# EAGLE schematic PowerSupply (EAGLE 9.0.0)

## Sheet 1 of 2
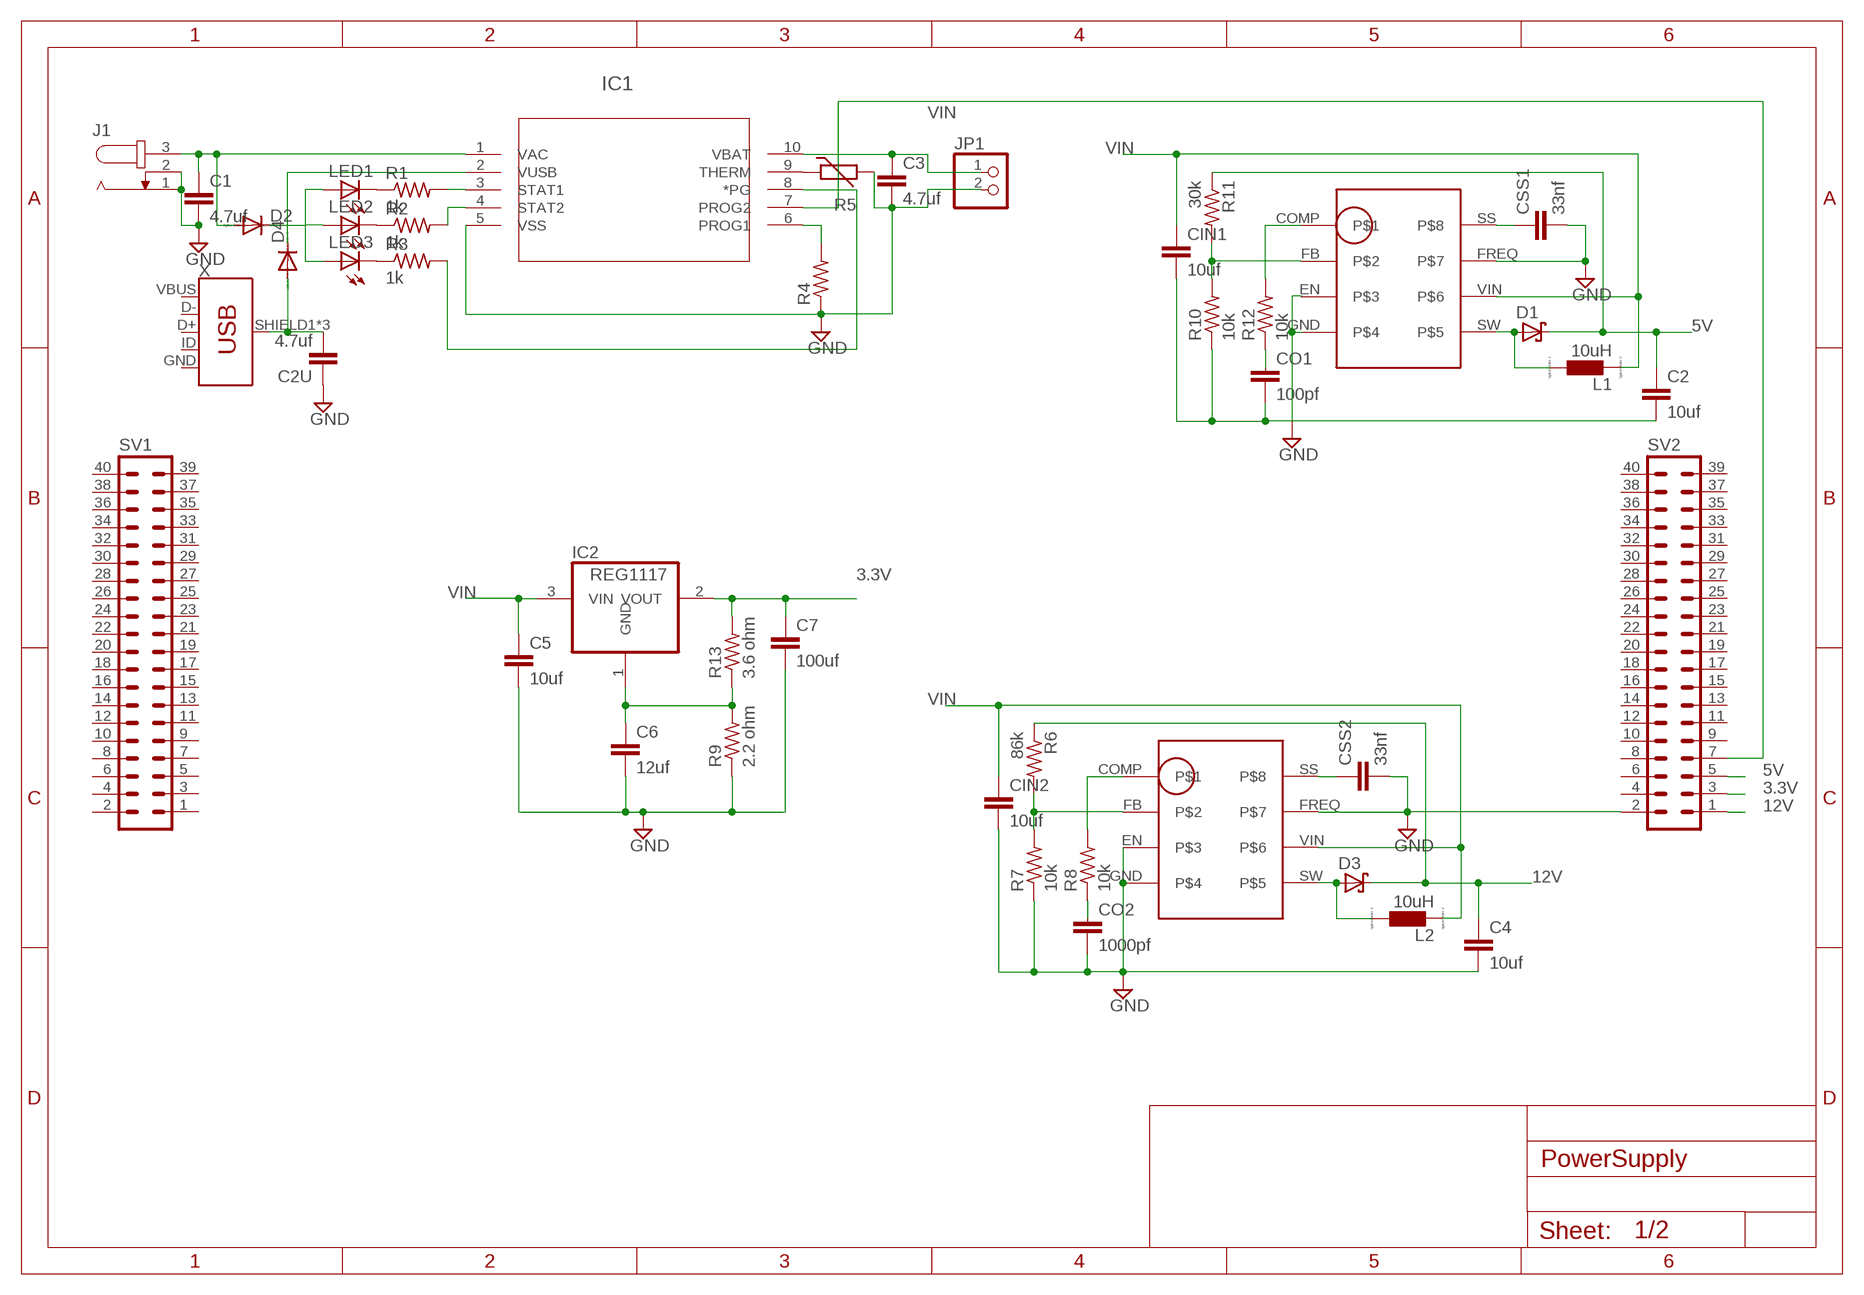
[diagram p0: schematic, sheet 1]

### Parts
C1  4.7uf  C-EUC1206  [C1206]
C2  10uf  C-EUC1206  [C1206]
C2U  4.7uf  C-EUC1206  [C1206]
C3  4.7uf  C-EUC1206  [C1206]
C4  10uf  C-EUC1206  [C1206]
C5  10uf  C-EUC1206  [C1206]
C6  12uf  C-EUC1206  [C1206]
C7  100uf  C-EUC1206  [C1206]
CIN1  10uf  C-EUC1206  [C1206]
CIN2  10uf  C-EUC1206  [C1206]
CO1  100pf  C-EUC1206  [C1206]
CO2  1000pf  C-EUC1206  [C1206]
CSS1  33nf  C-EUC1206  [C1206]
CSS2  33nf  C-EUC1206  [C1206]
D1  SCHOTTKY-DIODECB429-15  [CB429-15]
D2  DIODE-SOD123  [SOD123]
D3  SCHOTTKY-DIODECB429-15  [CB429-15]
D4  DIODE-SOD123  [SOD123]
IC1  MCP73837-FCI/UN  [SOP50P490X110-8N]
IC2  REG1117  [SOT223]
J1  JACK-PLUG1  [SPC4078]
JP1  PINHD-1X2  [1X02]
L1  10uH  L0204/7  [0204/7]
L2  10uH  L0204/7  [0204/7]
LED1  LEDSMT1206  [1206]
LED2  LEDSMT1206  [1206]
LED3  LEDSMT1206  [1206]
R1  1k  R-US_R2010  [R2010]
R2  1k  R-US_R2010  [R2010]
R3  1k  R-US_R2010  [R2010]
R4  R-US_R2010  [R2010]
R5  THERMISTOR-7,5  [R-7,5]
R6  86k  R-US_R2010  [R2010]
R7  10k  R-US_R2010  [R2010]
R8  10k  R-US_R2010  [R2010]
R9  2.2 ohm  R-US_MELF0207R  [MINI_MELF-0207R]
R10  10k  R-US_R2010  [R2010]
R11  30k  R-US_R2010  [R2010]
R12  10k  R-US_R2010  [R2010]
R13  3.6 ohm  R-US_MELF0207R  [MINI_MELF-0207R]
SV1  MA20-2  [MA20-2]
SV2  MA20-2  [MA20-2]
U1  ADP1613  ADP1613_DEV  [ADP1613_PAC]
U3  ADP1613  ADP1613_DEV  [ADP1613_PAC]
X  USB_MICRO-B_FEMALE-SMT  [USB-B-MICRO-SMD]

### Nets
3.3V: C7.1 IC2.2(VOUT) R13.2 SV2.3
5V: C2.1 D1.C R11.1 SV2.5
12V: C4.1 D3.C R6.1 SV2.1
GND: C1.2 C2.2 C2U.1 C3.2 C4.2 C5.2 C6.2 C7.2 CIN1.2 CIN2.2 CO1.2 CO2.2 CSS1.2 CSS2.2 IC1.5(VSS) J1.1 J1.2 JP1.2 R4.1 R5.2 R7.1 R9.1 R10.1 SV2.2 U1.FREQ U3.EN U3.FREQ U3.GND
N$1: IC1.3(STAT1) R1.2
N$2: IC1.4(STAT2) R2.2
N$3: LED3.C R3.1
N$4: LED1.C R1.1
N$5: LED2.C R2.1
N$6: IC1.8(*PG) R3.2
N$7: D2.C LED1.A LED2.A LED3.A
N$8: D4.C IC1.2(VUSB)
N$9: C1.1 D2.A IC1.1(VAC) J1.3
N$10: IC1.6(PROG1) R4.2
N$11: IC1.9(THERM) R5.1
N$12: CO2.1 R8.1
N$13: R12.2 U1.COMP
N$14: CO1.1 R12.1
N$15: R10.2 R11.2 U1.FB
N$16: R6.2 R7.2 U3.FB
N$17: D3.A L2.1 U3.SW
N$18: CSS2.1 U3.SS
N$19: D1.A L1.1 U1.SW
N$20: R8.2 U3.COMP
N$23: CSS1.1 U1.SS
N$24: C2U.2 D4.A X.SHIELD1(SHIELD) X.SHIELD2(SHIELD) X.SHIELD3(SHIELD)
N$25: IC1.7(PROG2) SV2.7
N$26: C6.1 IC2.1(GND) R9.2 R13.1
VIN: C3.1 C5.1 CIN1.1 CIN2.1 IC1.10(VBAT) IC2.3(VIN) JP1.1 L1.2 L2.2 U1.VIN U3.VIN
Unconnected: SV1.1 SV1.2 SV1.3 SV1.4 SV1.5 SV1.6 SV1.7 SV1.8 SV1.9 SV1.10 SV1.11 SV1.12 SV1.13 SV1.14 SV1.15 SV1.16 SV1.17 SV1.18 SV1.19 SV1.20 SV1.21 SV1.22 SV1.23 SV1.24 SV1.25 SV1.26 SV1.27 SV1.28 SV1.29 SV1.30 SV1.31 SV1.32 SV1.33 SV1.34 SV1.35 SV1.36 SV1.37 SV1.38 SV1.39 SV1.40 SV2.4 SV2.6 SV2.8 SV2.9 SV2.10 SV2.11 SV2.12 SV2.13 SV2.14 SV2.15 SV2.16 SV2.17 SV2.18 SV2.19 SV2.20 SV2.21 SV2.22 SV2.23 SV2.24 SV2.25 SV2.26 SV2.27 SV2.28 SV2.29 SV2.30 SV2.31 SV2.32 SV2.33 SV2.34 SV2.35 SV2.36 SV2.37 SV2.38 SV2.39 SV2.40 U1.EN U1.GND X.D+ X.D- X.ID

## Sheet 2 of 2

## Power pins joined to a net without a drawn wire
GND: X.GND
VBUS: X.VBUS

## Library data of the parts
C1 C2 C2U C3-C7 CIN1 CIN2 CO1 CO2 CSS1 CSS2 = rcl:C-EU: CAPACITOR, European symbol; SPICEPREFIX: C
D1 D3 = diode:SCHOTTKY-DIODE: Schottky Diode
D2 D4 = diode:DIODE-: DIODE
IC1 = MCP73837-FCI_UN:MCP73837-FCI/UN: Battery Charger; AVAILABILITY: Unavailable; DESCRIPTION: MCP73837 Series 6 V Linear Battery Charge Controller Surface Mount - MSOP-10; MF: Microchip; MP: MCP73837-FCI/UN; PACKAGE: MSOP-10 Microchip; PRICE: None
IC2 = burr-brown:REG1117: 800mA and 1A Low Dropout (LDO) Positive Regulator 1.8V, 2.5V, 2.85V, 3.3V, 5V, and Adj; MPN: REG1117; OC_FARNELL: 1097566; OC_NEWARK: 14P6981
J1 = con-jack:JACK-PLUG: DC POWER JACK Power Jack, DC, Right Angle, Through Hole, Rated 5A at 16VDC, PC Terminals Distributor: Farnell (www.Farnell.de) Drawing: 84N1161.pdf / 84N1162.pdf Manufacturer: SPC Technology (www.spctechnology.com) Type: SPC4077 / SPC 4078; OC_FARNELL: unknown; OC_NEWARK: unknown
JP1 = pinhead:PINHD-1X2: PIN HEADER
L1 L2 = eagle-ltspice:L: INDUCTOR, European symbol; SPICEMODEL: NONE; SPICEPREFIX: L
LED1-LED3 = led:LED: LED OSRAM: - CHIPLED LG R971, LG N971, LY N971, LG Q971, LY Q971, LO R971, LY R971 LH N974, LH R974 LS Q976, LO Q976, LY Q976 LO Q996 - Hyper CHIPLED LW Q18S LB Q993, LB Q99A, LB R99A - SideLED LS A670, LO A670, LY A670, LG A670, LP A670 LB A673, LV A673, LT A673, LW A673 LH A674 LY A675 LS A676, LA A676, LO A676, LY A676, LW A676 LS A679, LY A679, LG A679 - Hyper Micro SIDELED® LS Y876, LA Y876, LO Y876, LY Y876 LT Y87S - SmartLED LW L88C, LW L88S LB L89C, LB L89S, LG L890 LS L89K, LO L89K, LY L89K LS L896, LA L896, LO L896, LY L896 - TOPLED LS T670, LO T670, LY T670, LG T670, LP T670 LSG T670, LSP T670, LSY T670, LOP T670, LYG T670 LG T671, LOG T671, LSG T671 LB T673, LV T673, LT T673, LW T673 LH T674 LS T676, LA T676, LO T676, LY T676, LB T676, LH T676, LSB T676, LW T676 LB T67C, LV T67C, LT T67C, LS T67K, LO T67K, LY T67K, LW E67C LS E67B, LA E67B, LO E67B, LY E67B, LB E67C, LV E67C, LT E67C LW T67C LS T679, LY T679, LG T679 LS T770, LO T770, LY T770, LG T770, LP T770 LB T773, LV T773, LT T773, LW T773 LH T774 LS E675, LA E675, LY E675, LS T675 LS T776, LA T776, LO T776, LY T776, LB T776 LHGB T686 LT T68C, LB T68C - Hyper Mini TOPLED® LB M676 - Mini TOPLED Santana® LG M470 LS M47K, LO M47K, LY M47K Source: http://www.osram.convergy.de LUXEON: - LUMILED® LXK2-PW12-R00, LXK2-PW12-S00, LXK2-PW14-U00, LXK2-PW14-V00 LXK2-PM12-R00, LXK2-PM12-S00, LXK2-PM14-U00 LXK2-PE12-Q00, LXK2-PE12-R00, LXK2-PE12-S00, LXK2-PE14-T00, LXK2-PE14-U00 LXK2-PB12-K00, LXK2-PB12-L00, LXK2-PB12-M00, LXK2-PB14-N00, LXK2-PB14-P00, LXK2-PB14-Q00 LXK2-PR12-L00, LXK2-PR12-M00, LXK2-PR14-Q00, LXK2-PR14-R00 LXK2-PD12-Q00, LXK2-PD12-R00, LXK2-PD12-S00 LXK2-PH12-R00, LXK2-PH12-S00 LXK2-PL12-P00, LXK2-PL12-Q00, LXK2-PL12-R00 Source: www.luxeon.com KINGBRIGHT: KA-3528ASYC Source: www.kingbright.com
R1-R4 R6-R13 = resistor:R-US_: RESISTOR, American symbol
R5 = varistor:THERMISTOR: THERMISTOR
SV1 SV2 = con-lstb:MA20-2: PIN HEADER; OC_FARNELL: unknown; OC_NEWARK: unknown
U1 U3 = adp1613:ADP1613_DEV
X = SparkFun-Connectors:USB_MICRO-B: USB Type Micro-B Connector Male/female and PTH/SMT variants SparkFun Products: SparkFun microB USB Breakout <https://www.sparkfun.com/products/12035> SparkFun USB microB Plug Breakout <https://www.sparkfun.com/products/10031> SparkFun ESP8266 Thing <https://www.sparkfun.com/products/13231>; PROD_ID: CONN-11752